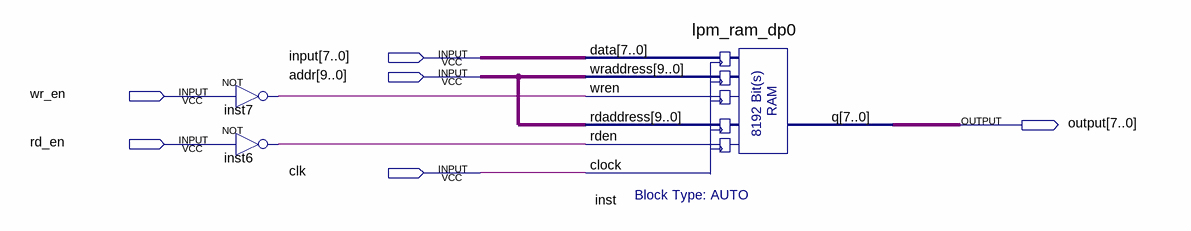
[diagram p0: schematic sheet]
// Quartus schematic StaticRAM.bdf as structural Verilog: 3 symbols, 6 pins
module StaticRAM (
  input  [7:0] \input ,
  input  [9:0] addr,
  input  wr_en,
  input  rd_en,
  input  clk,
  output [7:0] \output 
);

  wire inst6_out, inst7_out;

  not inst7 (inst7_out, wr_en);
  not inst6 (inst6_out, rd_en);
  lpm_ram_dp0 inst (
    .data(\input ), .wraddress(addr), .wren(inst7_out), .rdaddress(addr), .rden(inst6_out), .clock(clk),
    .q(\output ));
endmodule
